# Altium project TempProject.PrjPcb
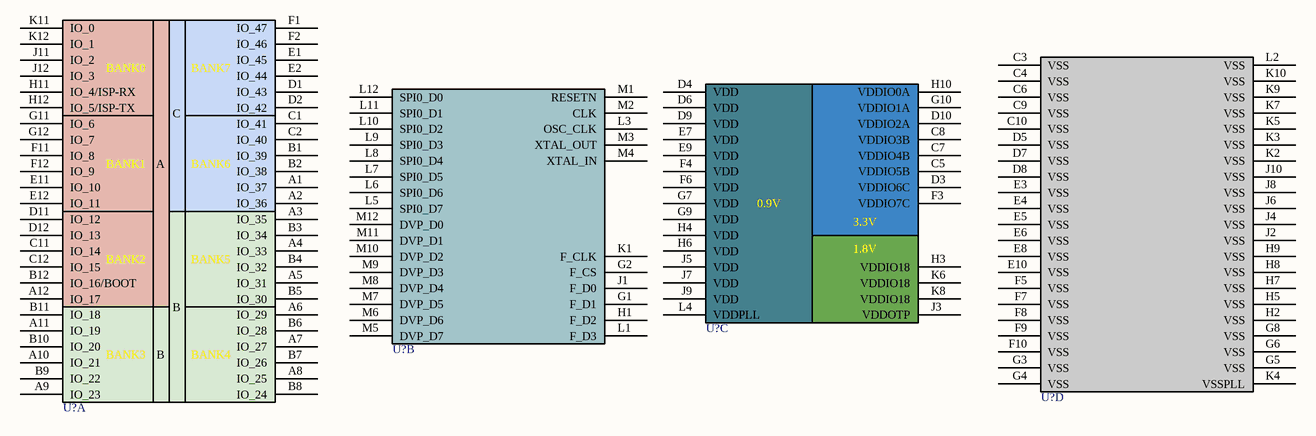
[diagram p0: Temp.SchDoc]
1 sheet, 4 parts. Net scope: global (net labels, ports and power ports of the same name join across sheets).
Board file: Temp.PcbDoc

## Sheet Temp.SchDoc
size A4; SheetNumber: 1; SheetTotal: 1

### Parts
(Parts that share a designator on the sheet are numbered #1, #2 ... from top to bottom, then left to right.)
U?#1  K210  [K210]  (value not drawn)  (part C of 4)
U?#2  K210  [K210]  (value not drawn)  (part A of 4)
U?#3  K210  [K210]  (value not drawn)  (part B of 4)
U?#4  K210  [K210]  (value not drawn)  (part D of 4)

### Nets

Not connected (* = marked no-connect by the designer): U?#1 C5(VDDIO5B) C7(VDDIO4B) C8(VDDIO3B) D3(VDDIO6C) D4(VDD) D6(VDD) D9(VDD) D10(VDDIO2A) E7(VDD) E9(VDD) F3(VDDIO7C) F4(VDD) F6(VDD) G7(VDD) G9(VDD) G10(VDDIO1A) H3(VDDIO18) H4(VDD) H6(VDD) H10(VDDIO0A) J3(VDDOTP) J5(VDD) J7(VDD) J9(VDD) K6(VDDIO18) K8(VDDIO18) L4(VDDPLL); U?#2 A1(IO_37) A2(IO_36) A3(IO_35) A4(IO_33) A5(IO_31) A6(IO_29) A7(IO_27) A8(IO_25) A9(IO_23) A10(IO_21) A11(IO_19) A12(IO_17) B1(IO_39) B2(IO_38) B3(IO_34) B4(IO_32) B5(IO_30) B6(IO_28) B7(IO_26) B8(IO_24) B9(IO_22) B10(IO_20) B11(IO_18) B12(IO_16/BOOT) C1(IO_41) C2(IO_40) C11(IO_14) C12(IO_15) D1(IO_43) D2(IO_42) D11(IO_12) D12(IO_13) E1(IO_45) E2(IO_44) E11(IO_10) E12(IO_11) F1(IO_47) F2(IO_46) F11(IO_8) F12(IO_9) G11(IO_6) G12(IO_7) H11(IO_4/ISP-RX) H12(IO_5/ISP-TX) J11(IO_2) J12(IO_3) K11(IO_0) K12(IO_1); U?#3 G1(F_D1) G2(F_CS) H1(F_D2) J1(F_D0) K1(F_CLK) L1(F_D3) L3(OSC_CLK) L5(SPI0_D7) L6(SPI0_D6) L7(SPI0_D5) L8(SPI0_D4) L9(SPI0_D3) L10(SPI0_D2) L11(SPI0_D1) L12(SPI0_D0) M1(RESETN) M2(CLK) M3(XTAL_OUT) M4(XTAL_IN) M5(DVP_D7) M6(DVP_D6) M7(DVP_D5) M8(DVP_D4) M9(DVP_D3) M10(DVP_D2) M11(DVP_D1) M12(DVP_D0); U?#4 C3(VSS) C4(VSS) C6(VSS) C9(VSS) C10(VSS) D5(VSS) D7(VSS) D8(VSS) E3(VSS) E4(VSS) E5(VSS) E6(VSS) E8(VSS) E10(VSS) F5(VSS) F7(VSS) F8(VSS) F9(VSS) F10(VSS) G3(VSS) G4(VSS) G5(VSS) G6(VSS) G8(VSS) H2(VSS) H5(VSS) H7(VSS) H8(VSS) H9(VSS) J2(VSS) J4(VSS) J6(VSS) J8(VSS) J10(VSS) K2(VSS) K3(VSS) K4(VSSPLL) K5(VSS) K7(VSS) K9(VSS) K10(VSS) L2(VSS)

### Notes on the sheet
- (in symbol K210, part A) BANK0; BANK7; C; BANK1; A; BANK6; BANK2; BANK5; B; BANK3; BANK4
- (in symbol K210, part C) 0.9V; 3.3V; 1.8V

### Library data of the parts
U?#1-U?#4 = K210: Kendryte210-MCU